# Altium schematic sheet ePaper_Display.SchDoc
size A3
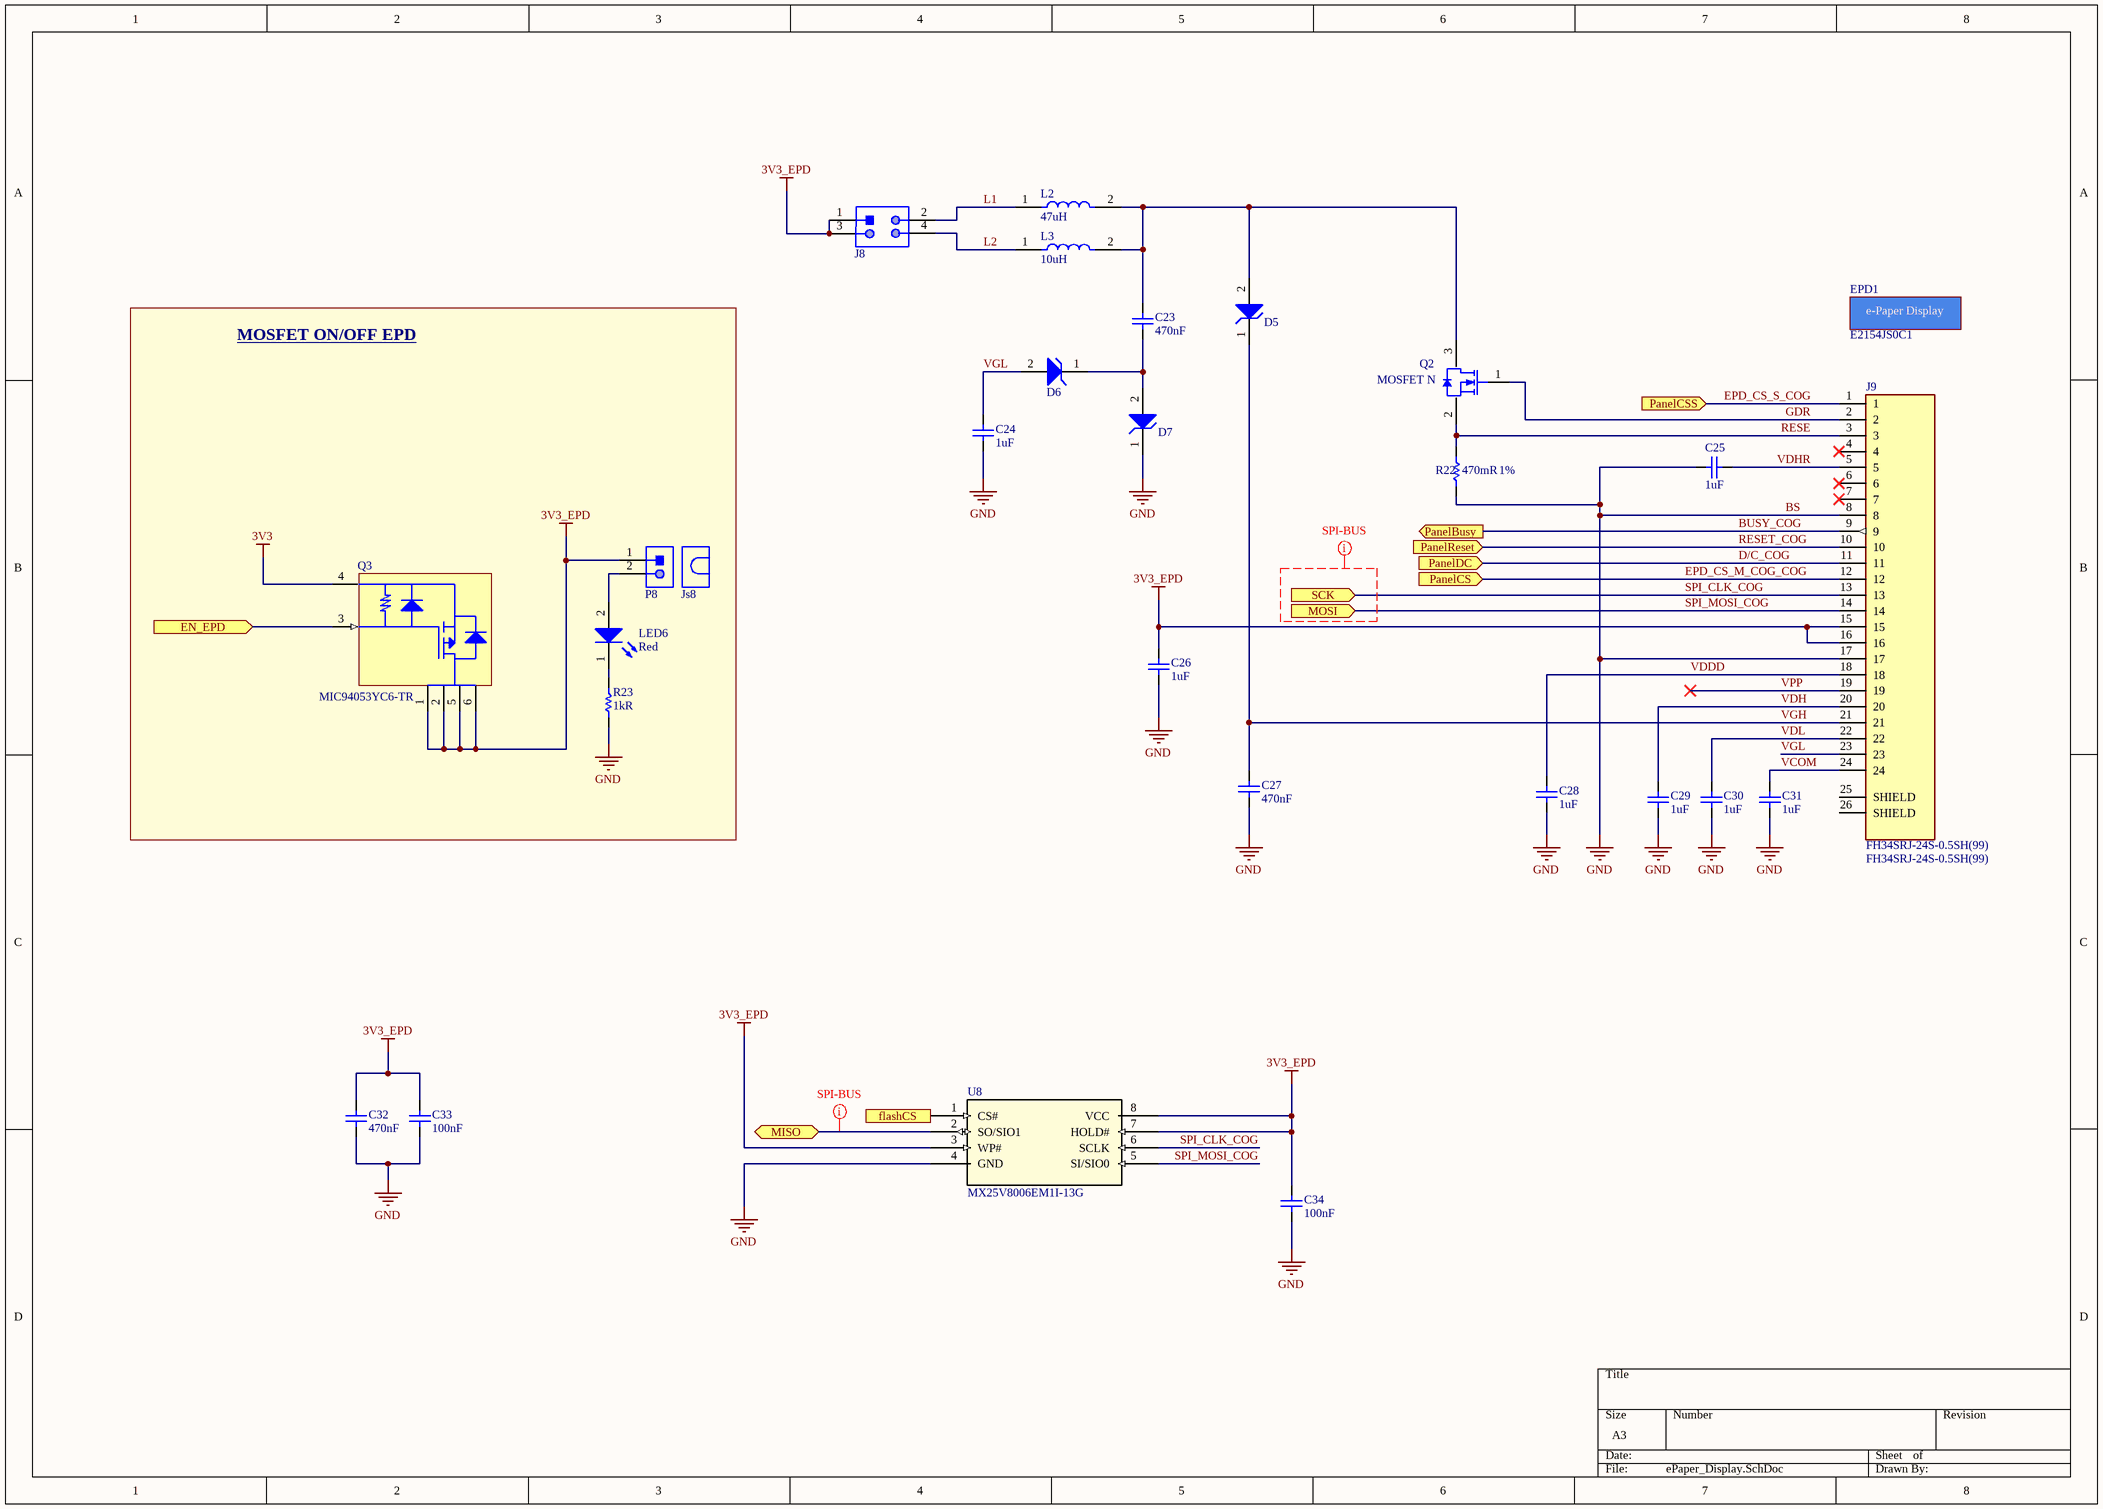
[diagram p0: ePaper_Display.SchDoc]

## Parts
C23  470nF  [Cap 0805 (2012 Metric)]
C24  1uF  [Cap 0805 (2012 Metric)]
C25  1uF  [Cap 0805 (2012 Metric)]
C26  1uF  [Cap 0805 (2012 Metric)]
C27  470nF  [Cap 0805 (2012 Metric)]
C28  1uF  [Cap 0805 (2012 Metric)]
C29  1uF  [Cap 0805 (2012 Metric)]
C30  1uF  [Cap 0805 (2012 Metric)]
C31  1uF  [Cap 0805 (2012 Metric)]
C32  470nF  [Cap 0805 (2012 Metric)]
C33  100nF  [Cap 0805 (2012 Metric)]
C34  100nF  [Cap 0805 (2012 Metric)]
D5  Diode  [Diode SOD123]  (value not drawn)
D6  Diode  [Diode SOD123]  (value not drawn)
D7  Diode  [Diode SOD123]  (value not drawn)
EPD1  E2154JS0C1
J8  Header 2x2  [Header 2x2]  (value not drawn)
J9  FH34SRJ-24S-0.5SH(99)  [FH34SRJ-24S-0.5SH(99)]
Js8  Jumper (2x1)  [Header JMP 2x1]  (value not drawn)
L2  47uH  [Ind 0805 (2012 METRIC)]
L3  10uH  [Ind 0805 (2012 METRIC)]
LED6  Red  [LED 0805(2012 METRIC)]
P8  Header 2x1  [Header 2x1]  (value not drawn)
Q2  MOSFET N  [Mosfet-N]
Q3  MIC94053YC6-TR  [SC-70-6]
R22  470mR  Tolerance: 1%  [Res 0603 (1608 Metric)]
R23  1kR  [Res 0805 (2012 Metric)]
U8  MX25V8006EM1I-13G  [MX25V8006EM1I-13G]

## Blocks framed on the sheet
MOSFET ON/OFF EPD: Js8 LED6 P8 Q3 R23

## Ports
EN_EPD (in), flashCS (in), MISO (bidir), MOSI (in), PanelBusy (out), PanelCS (in), PanelCSS (in), PanelDC (in), PanelReset (in), SCK (in)

## Nets
3V3: Q3.4(S)
3V3_EPD: C26.1 C32.1 C33.1 C34.1 J8.1 J8.3 J9.15 J9.16 P8.1 Q3.1(D) Q3.2(D) Q3.5(D) Q3.6(D) U8.3(WP#) U8.7(HOLD#) U8.8(VCC)
BS: C24.2 C25.2 C26.2 C27.2 C28.2 C29.2 C30.2 C31.2 C32.2 C33.2 C34.2 D7.1(K) J9.8 J9.17 R22.2 R23.2 U8.4(GND)  [also labelled GND]
BUSY_COG: J9.9 ; port PanelBusy
D/C_COG: J9.11 ; port PanelDC
EN_EPD: Q3.3(G) ; port EN_EPD
EPD_CS_M_COG_COG: J9.12 ; port PanelCS
EPD_CS_S_COG: J9.1 ; port PanelCSS
flashCS: U8.1(CS#) ; port flashCS
GDR: J9.2 Q2.1(G)
L1: J8.2 L2.1
L2: J8.4 L3.1
MISO: U8.2(SO/SIO1) ; port MISO
RESE: J9.3 Q2.2(S) R22.1
RESET_COG: J9.10 ; port PanelReset
SPI_CLK_COG: J9.13 U8.6(SCLK) ; port SCK
SPI_MOSI_COG: J9.14 U8.5(SI/SIO0) ; port MOSI
VCOM: C31.1 J9.24
VDDD: C28.1 J9.18
VDH: C29.1 J9.20
VDHR: C25.1 J9.5
VDL: C30.1 J9.22
VGH: C27.1 D5.1(K) J9.21
VGL: C24.1 D6.2(A) J9.23
VPP: J9.19
NetC23_1: C23.1 D5.2(A) L2.2 L3.2 Q2.3(D)
NetC23_2: C23.2 D6.1(K) D7.2(A)
NetLED6_1: LED6.1(K) R23.1
NetLED6_2: LED6.2(A) P8.2

Not connected (* = marked no-connect by the designer): J9 4* 6* 7* 25(SHIELD) 26(SHIELD)

## Layout directives
net class SPI-BUS: (no net found under the mark), MISO

## Notes on the sheet
- (in symbol ePaper-E2154JS0C1) e-Paper Display

## Library data of the parts
C23 C27 C32 = Capacitor: CAP CER 0.47UF 25V X7R 0805; Manufacturer: Samsung; Manufacturer Part Number: CL21B474KAFNNNE; Tolerance: 10%; Link: https://www.digikey.com/en/products/detail/samsung-electro-mechanics/CL21B474KAFNNNE/3886732; Supplier 1: Digi-Key; Supplier Part Number 1: 1276-1074-1-ND; RoHS: Yes; Category: Ceramic Capacitors; Stock 1: 290187; Pricing 1: 1=0,10000, 10=0,05400, 50=0,02920, 100=0,02390, 500=0,01706, 1000=0,01341 (USD); Mount: Surface Mount; Case/Package: 0805; Case Code (Metric): 2012; Case Code (Imperial): 0805; Contact Plating: Tin; Min Operating Temperature: -55°C; Max Operating Temperature: 125°C; Capacitance: 470nF; Dielectric: X7R; Package Quantity: 1; Packaging: Tape and Reel; Voltage Rating: 25V; Series: CL; Construction: Flat; Voltage Rating (DC): 25V; Length: 2mm; Width: 0.049inch; Height: 1.25mm; Thickness: 0.053inch; Depth: 1.25mm; Radiation Hardening: No; RoHS Compliant: Yes; Lead Free: Lead Free; ComponentLink1URL: https://datasheet.ciiva.com/25799/cl21b474kafnnne-25799985.pdf?src-supplier=Digi-Key; ComponentLink1Description: https://datasheet.ciiva.com/25799/cl21b474kafnnne-25799985.pdf?src-supplier=Digi-Key; ComponentLink2URL: https://datasheet.ciiva.com/26838/getdatasheetpartid-640001-26838737.pdf?src-supplier=Verical; ComponentLink2Description: https://datasheet.ciiva.com/26838/getdatasheetpartid-640001-26838737.pdf?src-supplier=Verical
C24-C26 C28-C31 = Capacitor: Ceramic capacitor SMD-0805 1000nF /16V X7R# K +-10%, Samsung, RoHS/3000pcs/; Manufacturer Part Number: CL21B105KOFNNNG; Voltage Rating: 16V; Tolerance: 10%; Dielectric: X7R; Link: https://www.digikey.com/es/products/detail/samsung-electro-mechanics/CL21B105KOFNNNG/3894469?s=N4IgTCBcDaIMIBkwEYBCyAMBWA0geQDEA5EgcRAF0BfIA; Supplier 1: Digi-Key; Supplier Part Number 1: 1276-6471-1-ND; Manufacturer: Samsung; RoHS: Yes; Category: Ceramic Capacitors; Stock 1: 36000; Pricing 1: 1=0,10000, 10=0,05700, 50=0,03120, 100=0,02540, 500=0,01816, 1000=0,01426 (USD); Mount: Surface Mount; Case/Package: 0805; Case Code (Metric): 2012; Case Code (Imperial): 0805; Material: Ceramic; Min Operating Temperature: -55°C; Max Operating Temperature: 125°C; Package Quantity: 3000; Packaging: Tape and Reel; Capacitance: 1uF; Voltage: 16V; Series: CL; Length: 2mm; Width: 0.049inch; Height: 1.25mm; Thickness: 0.053inch; Depth: 1.25mm; Lead Free: Lead Free; ComponentLink1URL: https://datasheet.ciiva.com/25733/cl21b105kofnnng-25733281.pdf?src-supplier=Digi-Key; ComponentLink1Description: https://datasheet.ciiva.com/25733/cl21b105kofnnng-25733281.pdf?src-supplier=Digi-Key; ComponentLink2URL: https://datasheet.ciiva.com/29199/455935-da-01-en-vs-kondensator-0805-29199047.pdf?src-supplier=Conrad; ComponentLink2Description: https://datasheet.ciiva.com/29199/455935-da-01-en-vs-kondensator-0805-29199047.pdf?src-supplier=Conrad; ComponentLink3URL: https://datasheet.ciiva.com/16428/cl05b104kq5nnnc-16428885.pdf?src-supplier=Future+Electronics; ComponentLink3Description: https://datasheet.ciiva.com/16428/cl05b104kq5nnnc-16428885.pdf?src-supplier=Future+Electronics; ComponentLink4URL: https://datasheet.ciiva.com/26310/mlcc-catalogdownload2013-eng-26310156.pdf?src-supplier=Distrelec; ComponentLink4Description: https://datasheet.ciiva.com/26310/mlcc-catalogdownload2013-eng-26310156.pdf?src-supplier=Distrelec
C33 C34 = Capacitor: YAGEO (PHYCOMP)         CC0805ZRY5V9BB104             SMD Multilayer Ceramic Capacitor, 0805 [2012 Metric], 0.1 uF, 50 V, +80%, -20%, Y5V, CC Series; Tolerance: 80%; Voltage Rating: 50V; Link: https://www.digikey.com/es/products/detail/yageo/CC0805ZRY5V9BB104/2103099?s=N4IgTCBcDaIMJwAwA5EFYBaAlAmmgagJwBCxAjIgCwgC6AvkA; Supplier 1: Digi-Key; Supplier Part Number 1: 311-1361-1-ND; Manufacturer: Yageo; Manufacturer Part Number: CC0805ZRY5V9BB104; RoHS: Yes; Category: Ceramic Capacitors; Stock 1: 92689; Pricing 1: 1=0,10000, 10=0,07000, 50=0,03800, 100=0,03100, 500=0,02214, 1000=0,01739 (USD); Mount: Surface Mount; Case/Package: 0805; Number of Pins: 2; Case Code (Metric): 2012; Case Code (Imperial): 0805; Material: Ceramic; Dielectric Material: Ceramic; Min Operating Temperature: -30°C; Max Operating Temperature: 85°C; Capacitance: 100nF; Dielectric: Y5V; Package Quantity: 1; Packaging: Tape and Reel; Voltage Rating (DC): 50V; Termination: SMD/SMT; Resistor Type: Ceramic; Series: CC; Construction: Flat; Length: 2mm; Width: 0.049inch; Height: 0.6mm; Depth: 1.25mm; Thickness: 0.024inch; Radiation Hardening: No; REACH SVHC: No SVHC; Lead Free: Lead Free; Halogen Free: Halogen Free; RoHS Compliant: Yes; ComponentLink1URL: https://datasheet.ciiva.com/144/mlccorderingcode-144209.pdf?src-supplier=Digi-Key; ComponentLink1Description: https://datasheet.ciiva.com/144/mlccorderingcode-144209.pdf?src-supplier=Digi-Key; ComponentLink2URL: https://datasheet.ciiva.com/144/mlccorderingcode-144210.pdf?src-supplier=Digi-Key; ComponentLink2Description: https://datasheet.ciiva.com/144/mlccorderingcode-144210.pdf?src-supplier=Digi-Key; ComponentLink3URL: https://datasheet.ciiva.com/144/mlccorderingcode-144211.pdf?src-supplier=Digi-Key; ComponentLink3Description: https://datasheet.ciiva.com/144/mlccorderingcode-144211.pdf?src-supplier=Digi-Key; ComponentLink4URL: https://datasheet.ciiva.com/11465/upy-gphc-y5v-6-3v-to-50v-5-11465865.pdf?src-supplier=Avnet; ComponentLink4Description: https://datasheet.ciiva.com/11465/upy-gphc-y5v-6-3v-to-50v-5-11465865.pdf?src-supplier=Avnet; ComponentLink5URL: https://datasheet.ciiva.com/13389/upy-gp-np0-16v-to-50v-8-13389351.pdf?src-supplier=Mouser; ComponentLink5Description: https://datasheet.ciiva.com/13389/upy-gp-np0-16v-to-50v-8-13389351.pdf?src-supplier=Mouser; ComponentLink6URL: https://datasheet.ciiva.com/17435/upy-gphc-y5v-6-3v-to-50v-5-17435053.pdf?src-supplier=Avnet+Europe; ComponentLink6Description: https://datasheet.ciiva.com/17435/upy-gphc-y5v-6-3v-to-50v-5-17435053.pdf?src-supplier=Avnet+Europe; ComponentLink7URL: https://datasheet.ciiva.com/15189/getdatasheetpartid-55882-15189238.pdf?src-supplier=Verical; ComponentLink7Description: https://datasheet.ciiva.com/15189/getdatasheetpartid-55882-15189238.pdf?src-supplier=Verical; ComponentLink8URL: https://datasheet.ciiva.com/16747/upy-gphc-y5v-6-3v-to-50v-5-revised-16747323.pdf?src-supplier=Future+Electronics; ComponentLink8Description: https://datasheet.ciiva.com/16747/upy-gphc-y5v-6-3v-to-50v-5-revised-16747323.pdf?src-supplier=Future+Electronics; ComponentLink9URL: https://datasheet.ciiva.com/28450/1132289-28450870.pdf?src-supplier=Element14; ComponentLink9Description: https://datasheet.ciiva.com/28450/1132289-28450870.pdf?src-supplier=Element14; ComponentLink10URL: https://datasheet.ciiva.com/29241/445331-da-01-en-kerko-chip-0805-y5v0-1uf-20-80proz50vg-29241946.pdf?src-supplier=Conrad; ComponentLink10Description: https://datasheet.ciiva.com/29241/445331-da-01-en-kerko-chip-0805-y5v0-1uf-20-80proz50vg-29241946.pdf?src-supplier=Conrad
D5-D7 = Diode: DIODE GEN PURP 75V 150MA 0603; Manufacturer: Taiwan Semiconductor; Manufacturer Part Number: TS4148CRZG; Forward Voltage: 1.25V; Peak Non-Repetitive Surge Current: 800mA; Element Configuration: Single; Max Forward Surge Current (Ifsm): 2A; Reverse Recovery Time: 4ns; Link: https://www.digikey.com/es/products/detail/taiwan-semiconductor-corporation/TS4148C-RZG/7359811?s=N4IgTCBcDaICoGUAsBGJAOAwgJQFoHEQBdAXyA; Supplier 1: Digi-Key; Supplier Part Number 1: TS4148CRZGCT-ND; RoHS: Yes; Category: Uncategorized; Stock 1: 278970; Pricing 1: 1=0,39000, 10=0,29400, 100=0,16640, 500=0,11022, 1000=0,08450, 2000=0,07348 (USD); Mount: Surface Mount; Case/Package: SMD/SMT; Number of Pins: 2; Min Operating Temperature: -55°C; Max Operating Temperature: 150°C; Packaging: Tape and Reel; Package Quantity: 5000; Max Repetitive Reverse Voltage (Vrrm): 75V; Radiation Hardening: No; RoHS Compliant: Yes; ComponentLink1URL: https://datasheet.ciiva.com/18168/getdatasheetpartid-464901-18168310.pdf?src-supplier=Verical; ComponentLink1Description: https://datasheet.ciiva.com/18168/getdatasheetpartid-464901-18168310.pdf?src-supplier=Verical
EPD1 = ePaper-E2154JS0C1: 1.54" Epd, Spectra, W.itc; Manufacturer: Pervasive Displays; Supplier 1: Digi-Key; RoHS: No; Stock 1: 290; Pricing 1: 1=4,96000 (USD); Supplier Part Number 1: 1452-E2154JS0C1-ND; Link: https://www.digikey.com/en/products/detail/pervasive-displays/E2154JS0C1/13572395?s=N4IgTCBcDaIKJgIwFYAsApAygBgMKJAF0BfIA; Manufacturer Part Number: E2154JS0C1
J9 = FH34SRJ-24S-0.5SH(99): CONN FPC/FFC 24POS .5MM; Manufacturer: Hirose; Actuator Material: Nylon,Polyamide; Number of Positions: 24; Voltage Rating: 50V; Current Rating: 500mA; Pitch: 0.02inch; Supplier 1: RSComponents; RoHS: Yes; Category: Headers and Wire Housings; Stock 1: 450; Mount: Surface Mount; Number of Pins: 24; Contact Material: Bronze; Contact Plating: Gold; Housing Material: Polymer; Min Operating Temperature: -55°C; Max Operating Temperature: 85°C; Packaging: Tape and Reel; Termination: Solder; Flammability Rating: UL94 V-0; RoHS Compliant: Yes; ComponentLink1URL: https://www.hirose.com/product/en/download_file/key_name/FH34SRJ/category/Catalog/doc_file_id/31646/?file_category_id=4&item_id=27&is_series=1&src-supplier=Digi-Key; ComponentLink1Description: https://www.hirose.com/product/en/download_file/key_name/FH34SRJ/category/Catalog/doc_file_id/31646/?file_category_id=4&item_id=27&is_series=1&src-supplier=Digi-Key; Link: https://www.digikey.com/en/products/detail/FH34SRJ-24S-0.5SH(99)/H124725CT-ND/5156028?itemSeq=375639459; Pricing 1: 10=2,28000, 100=1,89000, 250=1,66000 (GBP); Supplier Part Number 1: 1362403P; Manufacturer Part Number: FH34SRJ-24S-0.5SH(99)
Js8 = Jumper (2x1): 2 (1 x 2) Position Shunt Connector Black Open Top 0.100" (2.54mm) Gold; Manufacturer: Sullins; Manufacturer Part Number: QPC02SXGN-RC; Number of Positions: 2; Pitch: 0.1inch; Link: https://www.digikey.com/product-detail/en/sullins-connector-solutions/QPC02SXGN-RC/S9337-ND/2618262; Supplier 1: Digi-Key; Supplier Part Number 1: S9337-ND; RoHS: Yes; Category: Connectors; Stock 1: 529611; Pricing 1: 1=0,10000, 10=0,05900, 25=0,04400, 50=0,03780, 100=0,03650, 250=0,03152, 500=0,03024, 1000=0,02646, 2500=0,02394 (USD); Case/Package: 100; Contact Plating: Gold; Package Quantity: 2000; Packaging: Bulk; Height: 0.235inch; Lead Free: Lead Free; ComponentLink1URL: https://datasheet.ciiva.com/767/284-sxgn-11510-767869.pdf?src-supplier=Digi-Key; ComponentLink1Description: https://datasheet.ciiva.com/767/284-sxgn-11510-767869.pdf?src-supplier=Digi-Key
L2 = Inductor: Inductor Power Shielded Multi-Layer 47uH 20% 2MHz Ferrite 0.17A 4.81Ohm DCR 0805 T/R; Manufacturer: TDK; Manufacturer Part Number: MLZ2012M470WT000; DC Resistance (DCR): 4.81R; Self Resonant Frequency: 20MHz; Current Rating: 170mA; Saturation Current: 50mA; Link: https://www.digikey.com/es/products/detail/tdk-corporation/MLZ2012M470WT000/2465157?s=N4IgTCBcDaILIBkBaYAMBGMcAsB2VA6gCqqkgC6AvkA; Supplier 1: Digi-Key; Supplier Part Number 1: 445-6400-1-ND; RoHS: Yes; Category: Fixed Inductors; Stock 1: 82; Pricing 1: 1=0,13000, 10=0,11800, 25=0,10480, 50=0,08920, 100=0,07880, 250=0,07220, 500=0,06562, 1000=0,05512 (USD); Mount: Surface Mount; Case/Package: 0805; Core Material: Ferrite; Case Code (Metric): 2012; Case Code (Imperial): 0805; Min Operating Temperature: -55°C; Max Operating Temperature: 125°C; Packaging: Tape and Reel; Tolerance: 20%; Shielding: Shielded; Inductance: 47uH; Test Frequency: 2MHz; Package Quantity: 1; Length: 0.079inch; Width: 0.049inch; Height - Seated (Max): 0.057inch; Lead Free: Lead Free; ComponentLink1URL: https://datasheet.ciiva.com/29699/inductor-commercial-decoupling-mlz-en-29699064.pdf?src-supplier=Digi-Key; ComponentLink1Description: https://datasheet.ciiva.com/29699/inductor-commercial-decoupling-mlz-en-29699064.pdf?src-supplier=Digi-Key; ComponentLink2URL: https://datasheet.ciiva.com/29699/inductor-commercial-decoupling-mlz-en-29699065.pdf?src-supplier=Digi-Key; ComponentLink2Description: https://datasheet.ciiva.com/29699/inductor-commercial-decoupling-mlz-en-29699065.pdf?src-supplier=Digi-Key; ComponentLink3URL: https://datasheet.ciiva.com/29699/inductor-commercial-decoupling-mlz-en-29699067.pdf?src-supplier=Digi-Key; ComponentLink3Description: https://datasheet.ciiva.com/29699/inductor-commercial-decoupling-mlz-en-29699067.pdf?src-supplier=Digi-Key
L3 = Inductor: TDK - MLZ2012M100WT000 - High Frequency Inductor, 10 µH, MLZ Series, 350 mA, 0805 [2012 Metric], Multilayer, 0.47 ohm; Core Material: Ferrite; Tolerance: 20%; Shielding: Shielded; DC Resistance (DCR): 611mR; Self Resonant Frequency: 50MHz; Test Frequency: 2MHz; Current Rating: 350mA; Saturation Current: 200mA; Link: https://www.digikey.com/es/products/detail/tdk-corporation/MLZ2012M100WT000/2465153?s=N4IgTCBcDaILIBkBaYAMBGMd2tQdQBVdUQBdAXyA; Supplier 1: Avnet; Supplier Part Number 1: 05X0436; Manufacturer: TDK; Manufacturer Part Number: MLZ2012M100WT000; RoHS: Yes; Category: Fixed Inductors; Stock 1: 4; Pricing 1: 1=0,13000, 10=0,09800, 25=0,09500, 50=0,09100, 100=0,08800, 250=0,08200, 500=0,07600 (USD); Mount: Surface Mount; Case/Package: 0805; Case Code (Metric): 2012; Case Code (Imperial): 0805; Min Operating Temperature: -55°C; Max Operating Temperature: 125°C; Packaging: Tape and Reel; Inductance: 10uH; Package Quantity: 1; Length: 0.079inch; Width: 0.049inch; Height - Seated (Max): 0.057inch; Lead Free: Lead Free; ComponentLink1URL: https://datasheet.ciiva.com/29699/inductor-commercial-decoupling-mlz-en-29699061.pdf?src-supplier=Digi-Key; ComponentLink1Description: https://datasheet.ciiva.com/29699/inductor-commercial-decoupling-mlz-en-29699061.pdf?src-supplier=Digi-Key; ComponentLink2URL: https://datasheet.ciiva.com/29699/inductor-commercial-decoupling-mlz-en-29699062.pdf?src-supplier=Digi-Key; ComponentLink2Description: https://datasheet.ciiva.com/29699/inductor-commercial-decoupling-mlz-en-29699062.pdf?src-supplier=Digi-Key; ComponentLink3URL: https://datasheet.ciiva.com/29699/inductor-commercial-decoupling-mlz-en-29699063.pdf?src-supplier=Digi-Key; ComponentLink3Description: https://datasheet.ciiva.com/29699/inductor-commercial-decoupling-mlz-en-29699063.pdf?src-supplier=Digi-Key
LED6 = LED: SMD LED red 2.4 V 0805, 150080RS75000, Würth Elektronik; Manufacturer: Wurth Electronics; Luminous Intensity: 150mcd; Viewing Angle: 140°; Forward Voltage: 2V; Wavelength: 625nm; Lens Style: Clear,Rectangular; Forward Current: 30mA; Test Current: 20mA; Link: https://www.digikey.com/es/products/detail/w%C3%BCrth-elektronik/150080RS75000/4489918?s=N4IgTCBcDaIIwFYAMSAcSBKBlA7MlIAugL5A; Supplier 1: Digi-Key; Supplier Part Number 1: 732-4984-1-ND; Manufacturer Part Number: 150080RS75000; RoHS: Yes; Category: LEDs; Stock 1: 57843; Pricing 1: 1=0,18000, 50=0,16500, 100=0,14200, 500=0,12300 (USD); Mount: Surface Mount; Case/Package: 0805; Color: Red; Case Code (Metric): 2012; Case Code (Imperial): 0805; Min Operating Temperature: -40°C; Max Operating Temperature: 85°C; Package Quantity: 4000; Packaging: Tape and Reel; Dominant Wavelength: 625nm; Length: 2mm; Width: 1.25mm; Height: 0.7mm; REACH SVHC: Unknown; RoHS Compliant: Yes; ComponentLink1URL: https://datasheet.ciiva.com/22656/150080rs75000-22656961.pdf?src-supplier=Element14; ComponentLink1Description: https://datasheet.ciiva.com/22656/150080rs75000-22656961.pdf?src-supplier=Element14; ComponentLink2URL: https://datasheet.ciiva.com/29279/759435-da-01-en-chipled-0805-w-kl-rot-150080rs75000-29279032.pdf?src-supplier=Conrad; ComponentLink2Description: https://datasheet.ciiva.com/29279/759435-da-01-en-chipled-0805-w-kl-rot-150080rs75000-29279032.pdf?src-supplier=Conrad
P8 = Header 2x1: Connector Header Through Hole 2 position 0.100" (2.54mm); Manufacturer: Amphenol FCI; Manufacturer Part Number: 68001-402HLF; Number of Contacts: 2; Connector Type: Male Pin; Insulation Resistance: 5GR; Max Voltage Rating (AC): 1.5kV; Gender: Male; Current Rating: 3A; Contact Post Length: 3.05mm; Link: https://www.digikey.com/product-detail/en/amphenol-icc-fci/68001-402HLF/609-3507-ND/1530472; Supplier 1: Digi-Key; Supplier Part Number 1: 609-3507-ND; RoHS: Yes; Category: Headers and Wire Housings; Stock 1: 5598; Pricing 1: 1=0,12000, 10=0,11600, 100=0,07160, 500=0,05928, 1000=0,05187, 5000=0,04446, 10000=0,04323 (USD); Mount: Through Hole; Contact Plating: Tin; Housing Material: Thermoplastic; Housing Color: Black; Color: Black; Contact Material: Bronze; Min Operating Temperature: -65°C; Max Operating Temperature: 125°C; Termination: Solder; Number of Rows: 1; Number of Positions: 2; Orientation: Straight; Package Quantity: 100; Packaging: Bulk; Contact Gender: Male; Voltage Rating: 1.5kV; Length: 5.08mm; Pitch: 2.54mm; Contact Mating Length: 0.23inch; Depth: 2.41mm; Radiation Hardening: No; REACH SVHC: No SVHC; Flammability Rating: UL94 V-0; Lead Free: Lead Free; ComponentLink1URL: https://datasheet.ciiva.com/724/68000-724389.pdf?src-supplier=Digi-Key; ComponentLink1Description: https://datasheet.ciiva.com/724/68000-724389.pdf?src-supplier=Digi-Key; ComponentLink2URL: https://datasheet.ciiva.com/16726/68000-16726185.pdf?src-supplier=Avnet+Europe; ComponentLink2Description: https://datasheet.ciiva.com/16726/68000-16726185.pdf?src-supplier=Avnet+Europe; ComponentLink3URL: https://datasheet.ciiva.com/10149/68000-10149338.pdf?src-supplier=Avnet; ComponentLink3Description: https://datasheet.ciiva.com/10149/68000-10149338.pdf?src-supplier=Avnet; ComponentLink4URL: https://datasheet.ciiva.com/46385/1748756-46385306.pdf?src-supplier=Element14; ComponentLink4Description: https://datasheet.ciiva.com/46385/1748756-46385306.pdf?src-supplier=Element14
Q2 = MOSFET N: Trans MOSFET N-CH 60V 0.115A 3-Pin SOT-23 T/R; Manufacturer: ON Semiconductor; Manufacturer Part Number: 2N7002LT1G; Continuous Drain Current (ID): 115mA; Rds On Max: 7.5R; Max Power Dissipation: 225mW; Input Capacitance: 50pF; Gate to Source Voltage (Vgs): 20V; Number of Elements: 1; Power Dissipation: 300mW; Element Configuration: Single; Turn-Off Delay Time: 40ns; Turn-On Delay Time: 20ns; Threshold Voltage: 2.5V; Supplier 1: Avnet; RoHS: Yes; Category: MOSFETs; Stock 1: 702; Case/Package: SOT-23-3; Number of Pins: 3; Contact Plating: Tin,Matte; Min Operating Temperature: -55°C; Max Operating Temperature: 150°C; Packaging: Tape and Reel; Drain to Source Voltage (Vdss): 60V; Drain to Source Resistance: 7.5R; Package Quantity: 1; Drain to Source Breakdown Voltage: 60V; On-State Resistance: 7.5R; Nominal Vgs: 2.5V; Number of Channels: 1; Voltage Rating (DC): 60V; Current Rating: 115mA; Length: 3.04mm; Width: 1.4mm; Height: 1.01mm; Radiation Hardening: No; Lead Free: Lead Free; RoHS Compliant: Yes; REACH SVHC: No SVHC; Halogen Free: Halogen Free; ComponentLink1URL: https://datasheet.ciiva.com/936/2n7002l-d-936784.pdf?src-supplier=Digi-Key; ComponentLink1Description: https://datasheet.ciiva.com/936/2n7002l-d-936784.pdf?src-supplier=Digi-Key; ComponentLink2URL: https://datasheet.ciiva.com/22749/1747988-22749570.pdf?src-supplier=Element14; ComponentLink2Description: https://datasheet.ciiva.com/22749/1747988-22749570.pdf?src-supplier=Element14; ComponentLink3URL: https://datasheet.ciiva.com/1188/97418-1188470.pdf?src-supplier=Element14; ComponentLink3Description: https://datasheet.ciiva.com/1188/97418-1188470.pdf?src-supplier=Element14; ComponentLink4URL: https://datasheet.ciiva.com/936/2n7002l-d-936785.pdf?src-supplier=Digi-Key; ComponentLink4Description: https://datasheet.ciiva.com/936/2n7002l-d-936785.pdf?src-supplier=Digi-Key; ComponentLink5URL: https://datasheet.ciiva.com/936/2n7002l-d-936786.pdf?src-supplier=Digi-Key; ComponentLink5Description: https://datasheet.ciiva.com/936/2n7002l-d-936786.pdf?src-supplier=Digi-Key; ComponentLink6URL: https://datasheet.ciiva.com/3304/2n7002l-d-3304393.pdf?src-supplier=Avnet; ComponentLink6Description: https://datasheet.ciiva.com/3304/2n7002l-d-3304393.pdf?src-supplier=Avnet; ComponentLink7URL: https://datasheet.ciiva.com/8114/2n7002l-d-8114823.pdf?src-supplier=Avnet; ComponentLink7Description: https://datasheet.ciiva.com/8114/2n7002l-d-8114823.pdf?src-supplier=Avnet; ComponentLink8URL: https://datasheet.ciiva.com/16542/2n7002l-d-16542607.pdf?src-supplier=Avnet+Asia; ComponentLink8Description: https://datasheet.ciiva.com/16542/2n7002l-d-16542607.pdf?src-supplier=Avnet+Asia; ComponentLink9URL: https://datasheet.ciiva.com/1188/97418-1188471.pdf?src-supplier=Element14; ComponentLink9Description: https://datasheet.ciiva.com/1188/97418-1188471.pdf?src-supplier=Element14; ComponentLink10URL: https://datasheet.ciiva.com/26146/2n7002l-d-26146173.pdf?src-supplier=Avnet+Europe; ComponentLink10Description: https://datasheet.ciiva.com/26146/2n7002l-d-26146173.pdf?src-supplier=Avnet+Europe; ComponentLink11URL: https://datasheet.ciiva.com/24157/2n7002l-d-24157398.pdf?src-supplier=Future+Electronics; ComponentLink11Description: https://datasheet.ciiva.com/24157/2n7002l-d-24157398.pdf?src-supplier=Future+Electronics; ComponentLink12URL: https://datasheet.ciiva.com/1254/1747988-1254500.pdf?src-supplier=Newark; ComponentLink12Description: https://datasheet.ciiva.com/1254/1747988-1254500.pdf?src-supplier=Newark; Supplier Part Number 1: 39K1536; Pricing 1: 5=0,18500, 10=0,13200, 100=0,07300 (USD); Link: https://www.digikey.com/es/products/detail/on-semiconductor/2N7002LT1G/918297
Q3 = TransistorMosfet(Load): P-Channel 6V 2A (Ta) 270mW (Ta) Surface Mount SC-70-6; Manufacturer: Microchip; Link: https://www.digikey.com/product-detail/en/microchip-technology/MIC94053YC6-TR/576-2939-1-ND/1822099; Supplier 1: Digi-Key; Supplier Part Number 1: 576-2939-1-ND; Manufacturer Part Number: MIC94053YC6-TR; RoHS: Yes; Category: MOSFETs; Stock 1: 3005; Pricing 1: 1=0,58000, 25=0,48000, 100=0,46250 (USD); ComponentLink1URL: https://datasheet.ciiva.com/6379/mic94052-53-6379193.pdf?src-supplier=Digi-Key; ComponentLink1Description: https://datasheet.ciiva.com/6379/mic94052-53-6379193.pdf?src-supplier=Digi-Key; ComponentLink2URL: https://datasheet.ciiva.com/6379/mic94052-53-6379189.pdf?src-supplier=Digi-Key; ComponentLink2Description: https://datasheet.ciiva.com/6379/mic94052-53-6379189.pdf?src-supplier=Digi-Key; ComponentLink3URL: https://datasheet.ciiva.com/46408/264781-46408581.pdf?src-supplier=Element14; ComponentLink3Description: https://datasheet.ciiva.com/46408/264781-46408581.pdf?src-supplier=Element14; ComponentLink4URL: https://datasheet.ciiva.com/15200/getdatasheetpartid-111629-15200795.pdf?src-supplier=Verical; ComponentLink4Description: https://datasheet.ciiva.com/15200/getdatasheetpartid-111629-15200795.pdf?src-supplier=Verical
R22 = Resistor: Res Thick Film 0603 0.47 Ohm 1% 1/10W ±200ppm/°C Molded SMD SMD Paper Tape on Plastic Reel; Manufacturer: Bourns; Manufacturer Part Number: CRL0603-FW-R470ELF; Power Rating: 100mW; Link: https://www.digikey.com/en/products/detail/bourns-inc/CRL0603-FW-R470ELF/3784489; Supplier 1: Digi-Key; Supplier Part Number 1: CRL0603-FW-R470ELFCT-ND; RoHS: Yes; Category: Chip SMD Resistors; Stock 1: 17467; Pricing 1: 1=0,24000, 10=0,20500, 100=0,08010, 1000=0,03353, 2500=0,03074 (USD); Mount: Surface Mount; Case/Package: 0603; Number of Pins: 2; Contact Plating: Tin; Case Code (Metric): 1608; Case Code (Imperial): 0603; Min Operating Temperature: -55°C; Max Operating Temperature: 125°C; Resistance: 470mR; Resistor Type: Thick Film; Temperature Coefficient: 200ppm/°C; Packaging: Tape and Reel; Package Quantity: 5000; Number of Terminations: 2; Termination: SMD/SMT; Max Power Dissipation: 100mW; Series: CRL; Resistance Tolerance: 1%; Technology: THICK FILM; Construction: Rectangular; Length: 1.6mm; Width: 0.031inch; Height: 0.45mm; Depth: 0.8mm; Radiation Hardening: No; REACH SVHC: No SVHC; Military Standard: Not; RoHS Compliant: Yes; ComponentLink1URL: https://datasheet.ciiva.com/18608/crl-18608821.pdf?src-supplier=Digi-Key; ComponentLink1Description: https://datasheet.ciiva.com/18608/crl-18608821.pdf?src-supplier=Digi-Key; ComponentLink2URL: https://datasheet.ciiva.com/18608/crl-18608822.pdf?src-supplier=Digi-Key; ComponentLink2Description: https://datasheet.ciiva.com/18608/crl-18608822.pdf?src-supplier=Digi-Key; ComponentLink3URL: https://datasheet.ciiva.com/16929/crl-16929738.pdf?src-supplier=Avnet+Europe; ComponentLink3Description: https://datasheet.ciiva.com/16929/crl-16929738.pdf?src-supplier=Avnet+Europe; ComponentLink4URL: https://datasheet.ciiva.com/7986/1896411-7986247.pdf?src-supplier=Element14; ComponentLink4Description: https://datasheet.ciiva.com/7986/1896411-7986247.pdf?src-supplier=Element14; ComponentLink5URL: https://datasheet.ciiva.com/22713/1448069-22713321.pdf?src-supplier=Element14; ComponentLink5Description: https://datasheet.ciiva.com/22713/1448069-22713321.pdf?src-supplier=Element14
R23 = Resistor: RES 1K OHM 1% 1/4W 0805; Manufacturer: Stackpole Electronics; Manufacturer Part Number: RNCP0805FTD1K00; Power Rating: 250mW; Temperature Coefficient: 100ppm/°C; Link: https://www.digikey.com/es/products/detail/stackpole-electronics-inc/RNCP0805FTD1K00/2240229?s=N4IgTCBcDaIEoDkDCAFADADjQVgGIBUARARgGk00QBdAXyA; Supplier 1: Digi-Key; Supplier Part Number 1: RNCP0805FTD1K00CT-ND; RoHS: Yes; Category: Chip SMD Resistors; Stock 1: 316834; Pricing 1: 1=0,10000, 10=0,07000, 100=0,02830, 1000=0,01272, 2500=0,01104 (USD); Mount: Surface Mount; Case/Package: 0805; Case Code (Metric): 2012; Case Code (Imperial): 0805; Size Code: 0805; Min Operating Temperature: -55°C; Max Operating Temperature: 155°C; Tolerance: 1%; Resistance: 1kR; Packaging: Tape and Reel; Resistor Type: Thin Film; Number of Terminations: 2; Max Power Dissipation: 250mW; Features: Moisture Resistant,Anti-Sulfur; Series: RNCP; Length: 0.079inch; Width: 0.049inch; Height: 0.024inch; Lead Free: Lead Free; RoHS Compliant: Yes; ComponentLink1URL: https://www.seielect.com/catalog/SEI-Packaging.pdf?src-supplier=Digi-Key; ComponentLink1Description: https://www.seielect.com/catalog/SEI-Packaging.pdf?src-supplier=Digi-Key; ComponentLink2URL: https://www.seielect.com/Catalog/SEI-rncp.pdf?src-supplier=Digi-Key; ComponentLink2Description: https://www.seielect.com/Catalog/SEI-rncp.pdf?src-supplier=Digi-Key; ComponentLink3URL: http://www.seielect.com/Catalog/SEI-rncp.pdf?src-supplier=Future+Electronics; ComponentLink3Description: http://www.seielect.com/Catalog/SEI-rncp.pdf?src-supplier=Future+Electronics
U8 = MX25V8006EM1I-13G: MX25U Series 3.6 V 8 Mb (8 M x 1 / 4 M x 2) Surface Mount Serial Flash -SOP - 8; Manufacturer: Macronix; Operating Supply Voltage: 3.6V; Interface: SPI,Serial; Memory Type: FLASH,NOR; Frequency: 75MHz; Density: 8Mb; Supplier 1: Digi-Key; RoHS: Yes; Category: Flash; Stock 1: 38531; Mount: Surface Mount; Case/Package: SOIC; Min Operating Temperature: -40°C; Max Operating Temperature: 85°C; Package Quantity: 98; Packaging: Rail/Tube; Max Frequency: 75MHz; Series: MX25xxx05/06; Supply Voltage-Nom: 3.6V; Lead Free: Lead Free; Temperature Grade: INDUSTRIAL; RoHS Compliant: Yes; ComponentLink1URL: https://datasheet.ciiva.com/16348/mx25v8006em1i-13g-16348067.pdf?src-supplier=Future+Electronics; ComponentLink1Description: https://datasheet.ciiva.com/16348/mx25v8006em1i-13g-16348067.pdf?src-supplier=Future+Electronics; ComponentLink2URL: https://datasheet.ciiva.com/1905/mx25v8006e-1905271.pdf?src-supplier=Digi-Key; ComponentLink2Description: https://datasheet.ciiva.com/1905/mx25v8006e-1905271.pdf?src-supplier=Digi-Key; Link: https://www.digikey.com/es/products/detail/macronix/MX25V8006EM1I-13G/2744801; Supplier Part Number 1: 1092-1118-ND; Manufacturer Part Number: MX25V8006EM1I-13G; Pricing 1: 1=0,55000, 10=0,50500, 25=0,49920, 50=0,49600, 100=0,44350, 250=0,43976, 500=0,43324, 1000=0,41775, 5000=0,38050 (USD)